# EAGLE design Totoro (EAGLE 9.6.2)
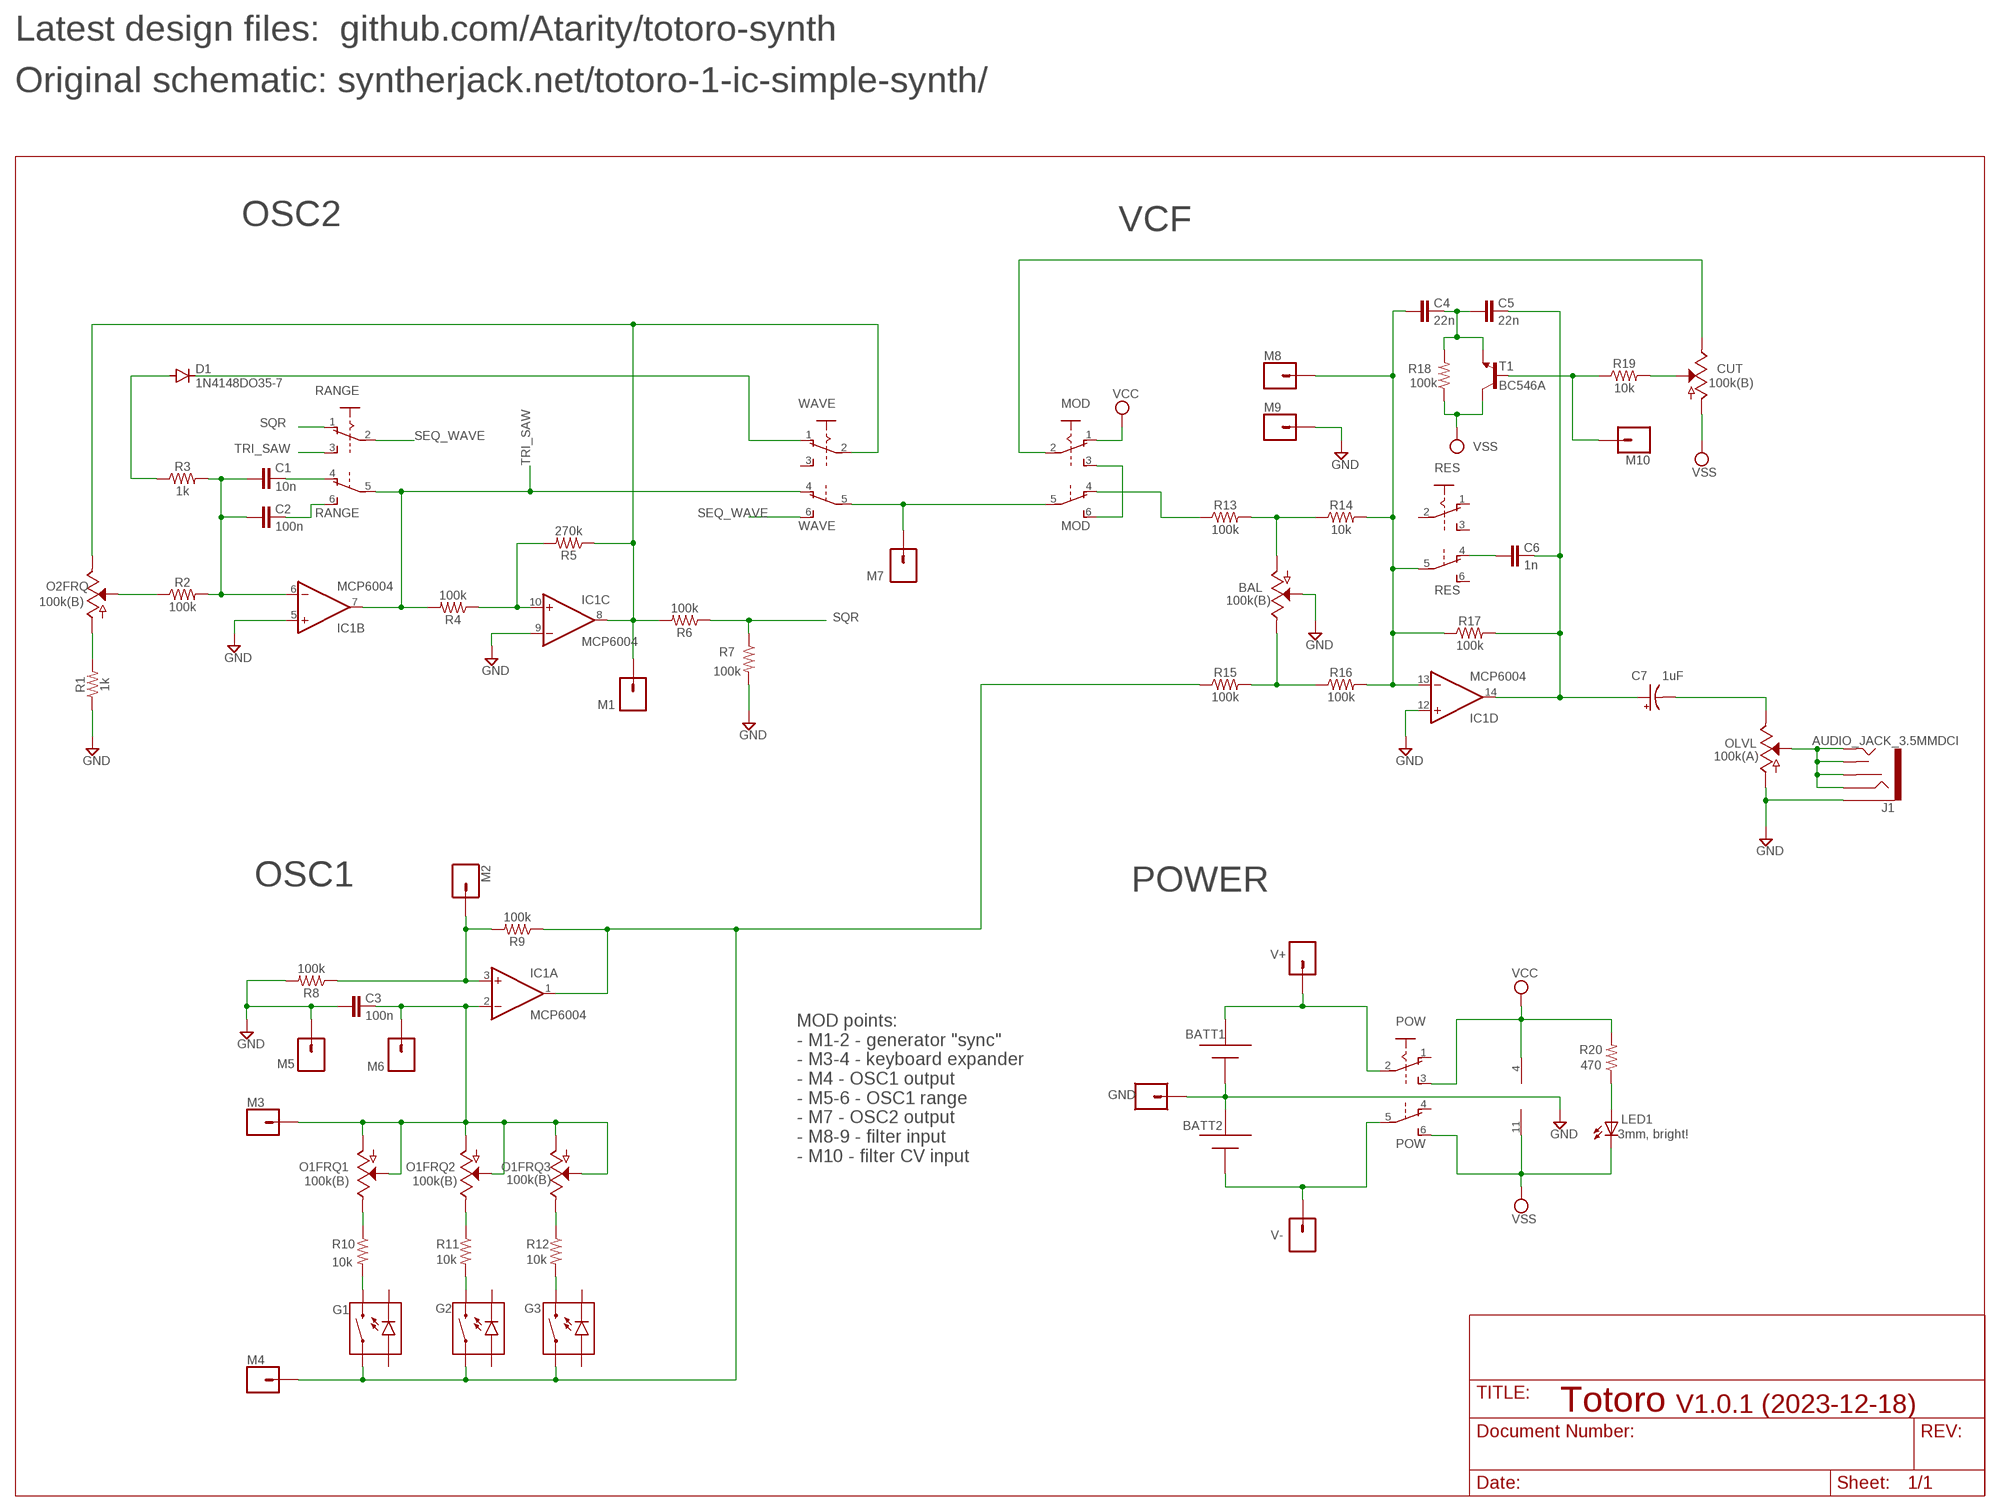
[diagram p0: schematic, sheet 1]

## Parts
BAL  100k(B)  POTENTIOMETER-GATE-SWAPPED  [POT-PTH-ALPS-KIT]
BATT1  ATARITY-AAAKLS5-817D  [KLS5-817-D]
BATT2  ATARITY-AAAKLS5-817D  [KLS5-817-D]
C1  10n  C-EU050-024X044  [C050-024X044]
C2  100n  C-EU050-024X044  [C050-024X044]
C3  100n  C-EU050-024X044  [C050-024X044]
C4  22n  C-EU050-024X044  [C050-024X044]
C5  22n  C-EU050-024X044  [C050-024X044]
C6  1n  C-EU050-024X044  [C050-024X044]
C7  1uF  10UF-POLAR-RADIAL-2.5MM-25V-20%  [CPOL-RADIAL-2.5MM-5MM]
CUT  100k(B)  POTENTIOMETER-GATE-SWAPPED  [POT-PTH-ALPS-KIT]
D1  1N4148DO35-7  [DO35-7]
G1  MECHANICAL-KEYBOARD1U  [CHERRY-MX-LED-1U]
G2  MECHANICAL-KEYBOARD1U  [CHERRY-MX-LED-1U]
G3  MECHANICAL-KEYBOARD1U  [CHERRY-MX-LED-1U]
GND  CONN_01  [1X01]
IC1  MCP6004  4AMP_P4+11N  [DIL14]
J1  AUDIO_JACK_3.5MMDCI  [DCI-ST-033]
LED1  3mm, bright!  LED3MM  [LED3MM]
M1  CONN_01  [1X01]
M2  CONN_01  [1X01]
M3  CONN_01  [1X01]
M4  CONN_01  [1X01]
M5  CONN_01  [1X01]
M6  CONN_01  [1X01]
M7  CONN_01  [1X01]
M8  CONN_01  [1X01]
M9  CONN_01  [1X01]
M10  CONN_01  [1X01]
MOD  PB22E07  [PB22E07]
O1FRQ1  100k(B)  POTENTIOMETER-GATE-SWAPPED  [POT-PTH-ALPS-KIT]
O1FRQ2  100k(B)  POTENTIOMETER-GATE-SWAPPED  [POT-PTH-ALPS-KIT]
O1FRQ3  100k(B)  POTENTIOMETER-GATE-SWAPPED  [POT-PTH-ALPS-KIT]
O2FRQ  100k(B)  POTENTIOMETER-GATE-SWAPPED  [POT-PTH-ALPS-KIT]
OLVL  100k(A)  POTENTIOMETER-GATE-SWAPPED  [POT-PTH-ALPS-KIT]
POW  PB22E07  [PB22E07]
R1  1k  RESISTORAXIAL-0.3  [AXIAL-0.3]
R2  100k  RESISTORAXIAL-0.3  [AXIAL-0.3]
R3  1k  RESISTORAXIAL-0.3  [AXIAL-0.3]
R4  100k  RESISTORAXIAL-0.3  [AXIAL-0.3]
R5  270k  RESISTORAXIAL-0.3  [AXIAL-0.3]
R6  100k  RESISTORAXIAL-0.3  [AXIAL-0.3]
R7  100k  RESISTORAXIAL-0.3  [AXIAL-0.3]
R8  100k  RESISTORAXIAL-0.3  [AXIAL-0.3]
R9  100k  RESISTORAXIAL-0.3  [AXIAL-0.3]
R10  10k  RESISTORAXIAL-0.3  [AXIAL-0.3]
R11  10k  RESISTORAXIAL-0.3  [AXIAL-0.3]
R12  10k  RESISTORAXIAL-0.3  [AXIAL-0.3]
R13  100k  RESISTORAXIAL-0.3  [AXIAL-0.3]
R14  10k  RESISTORAXIAL-0.3  [AXIAL-0.3]
R15  100k  RESISTORAXIAL-0.3  [AXIAL-0.3]
R16  100k  RESISTORAXIAL-0.3  [AXIAL-0.3]
R17  100k  RESISTORAXIAL-0.3  [AXIAL-0.3]
R18  100k  RESISTORAXIAL-0.3  [AXIAL-0.3]
R19  10k  RESISTORAXIAL-0.3  [AXIAL-0.3]
R20  470  RESISTORAXIAL-0.3  [AXIAL-0.3]
RANGE  PB22E07  [PB22E07]
RES  PB22E07  [PB22E07]
T1  BC546A  [TO92-EBC]
V+  CONN_01  [1X01]
V-  CONN_01  [1X01]
WAVE  PB22E07  [PB22E07]

## Nets
GND: BAL.P$2(S) BATT1.+ BATT2.- C3.2 GND.1 IC1.5(B:+IN) IC1.9(C:-IN) IC1.12(D:+IN) J1.P2(SLEEVE) J1.P3(SLEEVE) M5.1 M9.1 OLVL.P$1(A) R1.P$1 R7.P$2 R8.P$2
N$1: C1.2 C2.2 IC1.6(B:-IN) R2.P$2 R3.P$2
N$2: O2FRQ.P$2(S) R2.P$1
N$3: O2FRQ.P$1(A) R1.P$2
N$4: C1.1 RANGE.4(B:O)
N$5: C2.1 RANGE.6(B:S)
N$6: M7.1 MOD.5(B:P) WAVE.5(B:P)
N$7: IC1.10(C:+IN) R4.P$1 R5.P$2
N$8: IC1.8(C:OUT) M1.1 O2FRQ.P$3(E) R5.P$1 R6.P$2 WAVE.2(A:P)
N$9: D1.A R3.P$1
N$10: D1.C WAVE.1(A:O)
N$11: MOD.3(A:S) MOD.6(B:S)
N$12: MOD.4(B:O) R13.P$1
N$13: BAL.P$3(E) R15.P$2 R16.P$1
N$14: BAL.P$1(A) R13.P$2 R14.P$1
N$15: C4.2 IC1.13(D:-IN) M8.1 R14.P$2 R16.P$2 R17.P$1 RES.5(B:P)
N$16: C6.2 RES.4(B:O)
N$17: C5.1 C6.1 C7.1(+) IC1.14(D:OUT) R17.P$2
N$18: M10.1 R19.P$1 T1.B
N$19: C4.1 C5.2 R18.P$2 T1.E
N$20: CUT.P$2(S) R19.P$2
N$21: CUT.P$3(E) MOD.2(A:P)
N$22: C7.2(-) OLVL.P$3(E)
N$23: J1.P0(TIP) J1.P1(RING) J1.P4(RSH) J1.P5(TSH) OLVL.P$2(S)
N$24: O1FRQ3.P$3(E) R12.P$1
N$25: G1.S2 R10.P$2
N$26: O1FRQ2.P$3(E) R11.P$1
N$27: G2.S2 R11.P$2
N$28: O1FRQ1.P$3(E) R10.P$1
N$29: G3.S2 R12.P$2
N$31: C3.1 IC1.2(A:-IN) M3.1 M6.1 O1FRQ1.P$1(A) O1FRQ1.P$2(S) O1FRQ2.P$1(A) O1FRQ2.P$2(S) O1FRQ3.P$1(A) O1FRQ3.P$2(S)
N$32: IC1.3(A:+IN) M2.1 R8.P$1 R9.P$2
N$34: G1.S1 G2.S1 G3.S1 IC1.1(A:OUT) M4.1 R9.P$1 R15.P$1
N$35: LED1.A R20.P$1
N$37: BATT1.- POW.2(A:P) V+.1
N$38: BATT2.+ POW.5(B:P) V-.1
SEQ_WAVE: RANGE.2(A:P) WAVE.6(B:S)
SQR: R6.P$1 R7.P$1 RANGE.1(A:O)
TRI_SAW: IC1.7(B:OUT) R4.P$2 RANGE.3(A:S) RANGE.5(B:P) WAVE.4(B:O)
VCC: IC1.4(P:V+) MOD.1(A:O) POW.3(A:S) R20.P$2
VSS: CUT.P$1(A) IC1.11(P:V-) LED1.K(C) POW.6(B:S) R18.P$1 T1.C
Unconnected: G1.A G1.K(C) G2.A G2.K(C) G3.A G3.K(C) POW.1(A:O) POW.4(B:O) RES.1(A:O) RES.2(A:P) RES.3(A:S) RES.6(B:S) WAVE.3(A:S)

## Notes on the sheet
- Latest design files:  github.com/Atarity/totoro-synth
- Original schematic: syntherjack.net/totoro-1-ic-simple-synth/
- OSC2 | VCF
- OSC1 | POWER
- MOD points:
  - M1-2 - generator "sync"
  - M3-4 - keyboard expander
  - M4 - OSC1 output
  - M5-6 - OSC1 range
  - M7 - OSC2 output
  - M8-9 - filter input
  - M10 - filter CV input
- V1.0.1 (2023-12-18)

## Library data of the parts
BAL CUT O1FRQ1-O1FRQ3 O2FRQ OLVL = SparkFun-Resistors:POTENTIOMETER: Potentiometer (Pot) Three-terminal potentiometers, with an adjustable wiper and two adjustable resistors. A pot can be used to create a configurable voltage divider, or as a variable resistor. Variants ALPS_POT and ALPS_POT_KIT - PTH, breadboard compatible, 9mm square pots Rotary Potentiometer - Linear (10k ohm) <https://www.sparkfun.com/products/9288> (COM-09288) The KIT variant exposes copper on only one side of the PTH pad, so the part can only be assembled on one side of the PCB. Useful for beginner soldering kits.
BATT1 BATT2 = adafruit:ATARITY-AAA: AAA PC pin holder Mouser part #12BH412 - but pretty much any 1x AAA battery holder should be the same http://www.ladyada.net/library/pcb/eaglelibrary.html
C1-C6 = rcl:C-EU: CAPACITOR, European symbol; SPICEPREFIX: C
C7 = SparkFun-Capacitors:10UF-POLAR: 10.0µF polarized capacitors A capacitor is a passive two-terminal electrical component used to store electrical energy temporarily in an electric field.; PROD_ID: CAP-08440; VALUE: 10uF
D1 = diode:1N4148: DIODE high speed (Philips)
G1-G3 = SparkFun-Switches:MECHANICAL-KEYBOARD: Mechanical Keyboard Spacings for Cherry-MX Cherry-MX w/ LED switch footprints. Each package variant contains a bounding box on the tDocu layer for proper key spacing and a dimensional drawing on the Reference layer to be exported for laser cut mounting plates. Footprints are off-center so that the origin lies on the lower left corner of the key-spacing. This allows for most common layouts to be easily acheived on a grid spacing of 0.1875" Variants 1U through 1.75U in .25U steps Centered switch cutout in SwitchPlate layer with no stabilizers 2U through 2.75U in .25U steps Centered switch cutout in SwitchPlate layer with Cherry+Costar stabilizer holes 6.25U Common spacebar size Centered switch cutout in SwitchPlate layer with Cherry+Costar stabilizer holes "Big Ass" Enter ANSI 104 "Big Ass" Enter Key layout ISO Enter ISO style Enter Key layout
GND M1-M10 V+ V- = SparkFun-Connectors:CONN_01: Single connection point. Often used as Generic Header-pin footprint for 0.1 inch spaced/style header connections On any of the 0.1 inch spaced packages, you can populate with these: Break Away Headers - Straight <https://www.sparkfun.com/products/116> (PRT-00116) Break Away Male Headers - Right Angle <https://www.sparkfun.com/products/553> (PRT-00553) Female Headers <https://www.sparkfun.com/products/115> (PRT-00115) Break Away Headers - Machine Pin <https://www.sparkfun.com/products/117> (PRT-00117) Break Away Female Headers - Swiss Machine Pin <https://www.sparkfun.com/products/743> (PRT-00743) This device is also useful as a general connection point to wire up your design to another part of your project. Our various solder wires solder well into these plated through hole pads. Hook-Up Wire - Assortment (Stranded, 22 AWG) <https://www.sparkfun.com/products/11375> (PRT-11375) Hook-Up Wire - Assortment (Solid Core, 22 AWG) <https://www.sparkfun.com/products/11367> (PRT-11367) View the entire wire category on our website here <https://www.sparkfun.com/categories/141> Special notes: SMTSO-256-ET is a "flush mount" nut for a 4-40 screw. We mostly use this on specialty testbeds; it is a nice way to connect hardware to your PCB at an adjustable hieght. Also note, the SNAP packages are for using a snappable style connector. We sell a baggie of snaps and they are also used on two LilyPad designs: Snap Assortment - 30 pack (male and female) <https://www.sparkfun.com/products/11347> (DEV-11347) LilyPad Arduino SimpleSnap <https://www.sparkfun.com/products/10941> (DEV-10941) LilyPad SimpleSnap Protoboard <https://www.sparkfun.com/products/10940> (DEV-10940)
IC1 = linear:4AMP_P4+11: OP AMP
J1 = SparkFun-Connectors:AUDIO_JACK_3.5MM: Audio Jack 3.5mm variants of PTH and SMT stereo audio jack with bypass switches. SparkFun Products: SparkFun SparkPunk Sound Kit <[https://www.sparkfun.com/products/11177]> - PTH MP3 Trigger <https://www.sparkfun.com/products/13720> -3.5mm SMD SparkFun PicoBoard <https://www.sparkfun.com/products/11888>- 2.5mm SMD
LED1 = adafruit:LED: LED OSRAM: - CHIPLED LG R971, LG N971, LY N971, LG Q971, LY Q971, LO R971, LY R971 LH N974, LH R974 LS Q976, LO Q976, LY Q976 LO Q996 - Hyper CHIPLED LW Q18S LB Q993, LB Q99A, LB R99A - SideLED LS A670, LO A670, LY A670, LG A670, LP A670 LB A673, LV A673, LT A673, LW A673 LH A674 LY A675 LS A676, LA A676, LO A676, LY A676, LW A676 LS A679, LY A679, LG A679 - Hyper Micro SIDELED® LS Y876, LA Y876, LO Y876, LY Y876 LT Y87S - SmartLED LW L88C, LW L88S LB L89C, LB L89S, LG L890 LS L89K, LO L89K, LY L89K LS L896, LA L896, LO L896, LY L896 - TOPLED LS T670, LO T670, LY T670, LG T670, LP T670 LSG T670, LSP T670, LSY T670, LOP T670, LYG T670 LG T671, LOG T671, LSG T671 LB T673, LV T673, LT T673, LW T673 LH T674 LS T676, LA T676, LO T676, LY T676, LB T676, LH T676, LSB T676, LW T676 LB T67C, LV T67C, LT T67C, LS T67K, LO T67K, LY T67K, LW E67C LS E67B, LA E67B, LO E67B, LY E67B, LB E67C, LV E67C, LT E67C LW T67C LS T679, LY T679, LG T679 LS T770, LO T770, LY T770, LG T770, LP T770 LB T773, LV T773, LT T773, LW T773 LH T774 LS E675, LA E675, LY E675, LS T675 LS T776, LA T776, LO T776, LY T776, LB T776 LHGB T686 LT T68C, LB T68C - Hyper Mini TOPLED® LB M676 - Mini TOPLED Santana® LG M470 LS M47K, LO M47K, LY M47K Source: http://www.osram.convergy.de/
MOD POW RANGE RES WAVE = atarity-switch-pb22e07:PB22E07: SLIDING SWITCH Siemens, distributor Buerklin, 11G766
R1-R20 = SparkFun-Resistors:RESISTOR: Generic Resistor Package
T1 = transistor-npn:BC546*: NPN Transistor

## Board
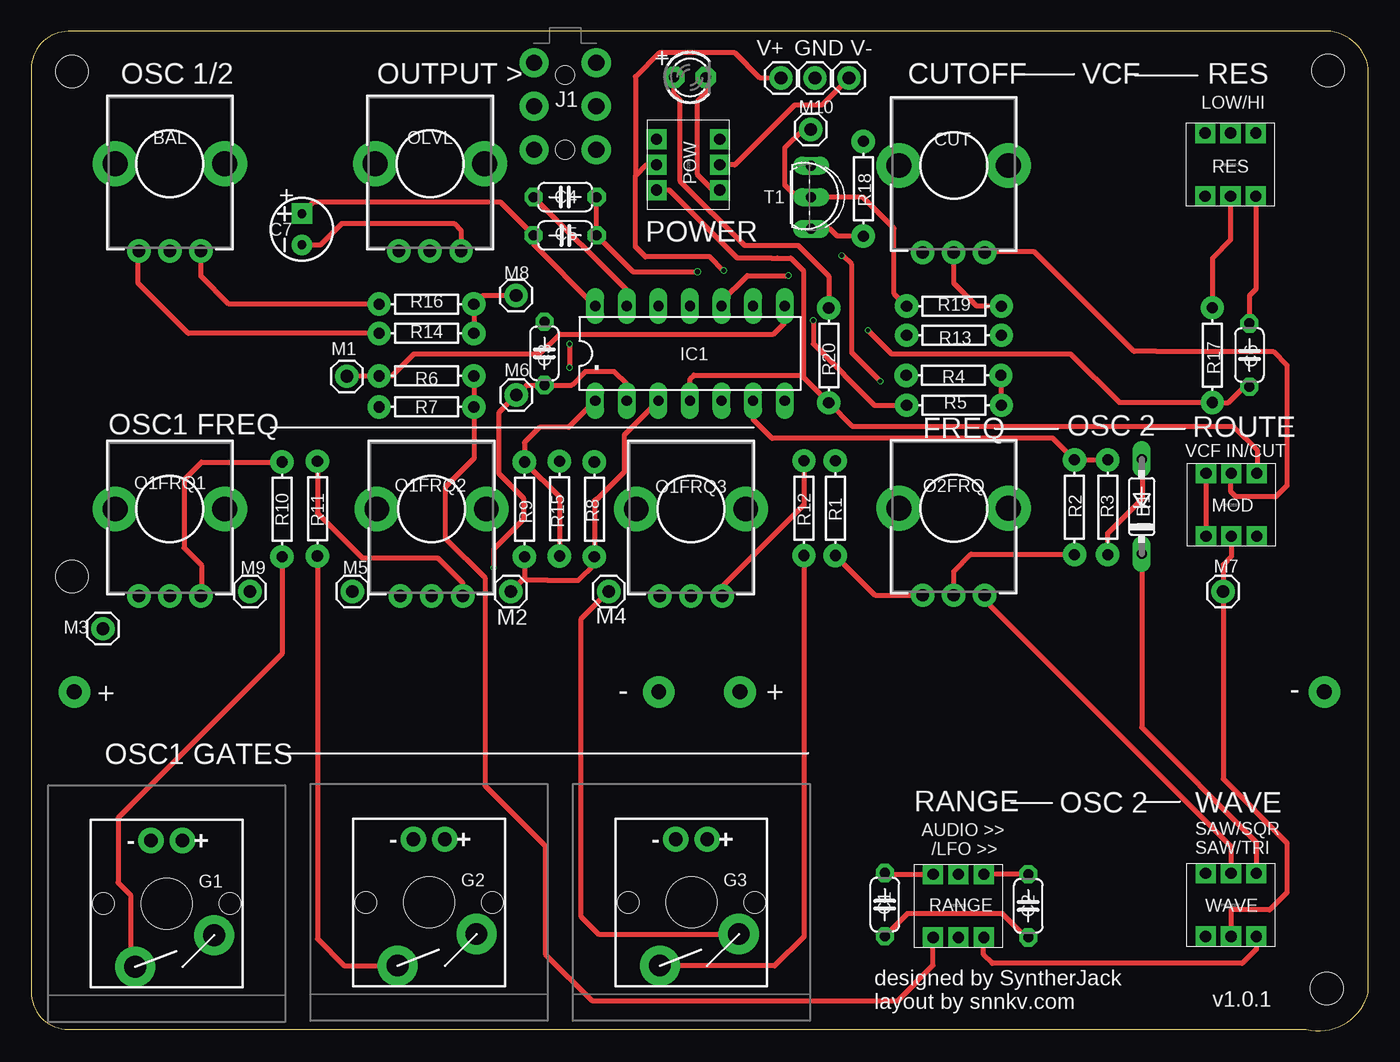
[diagram p1: board, top side]
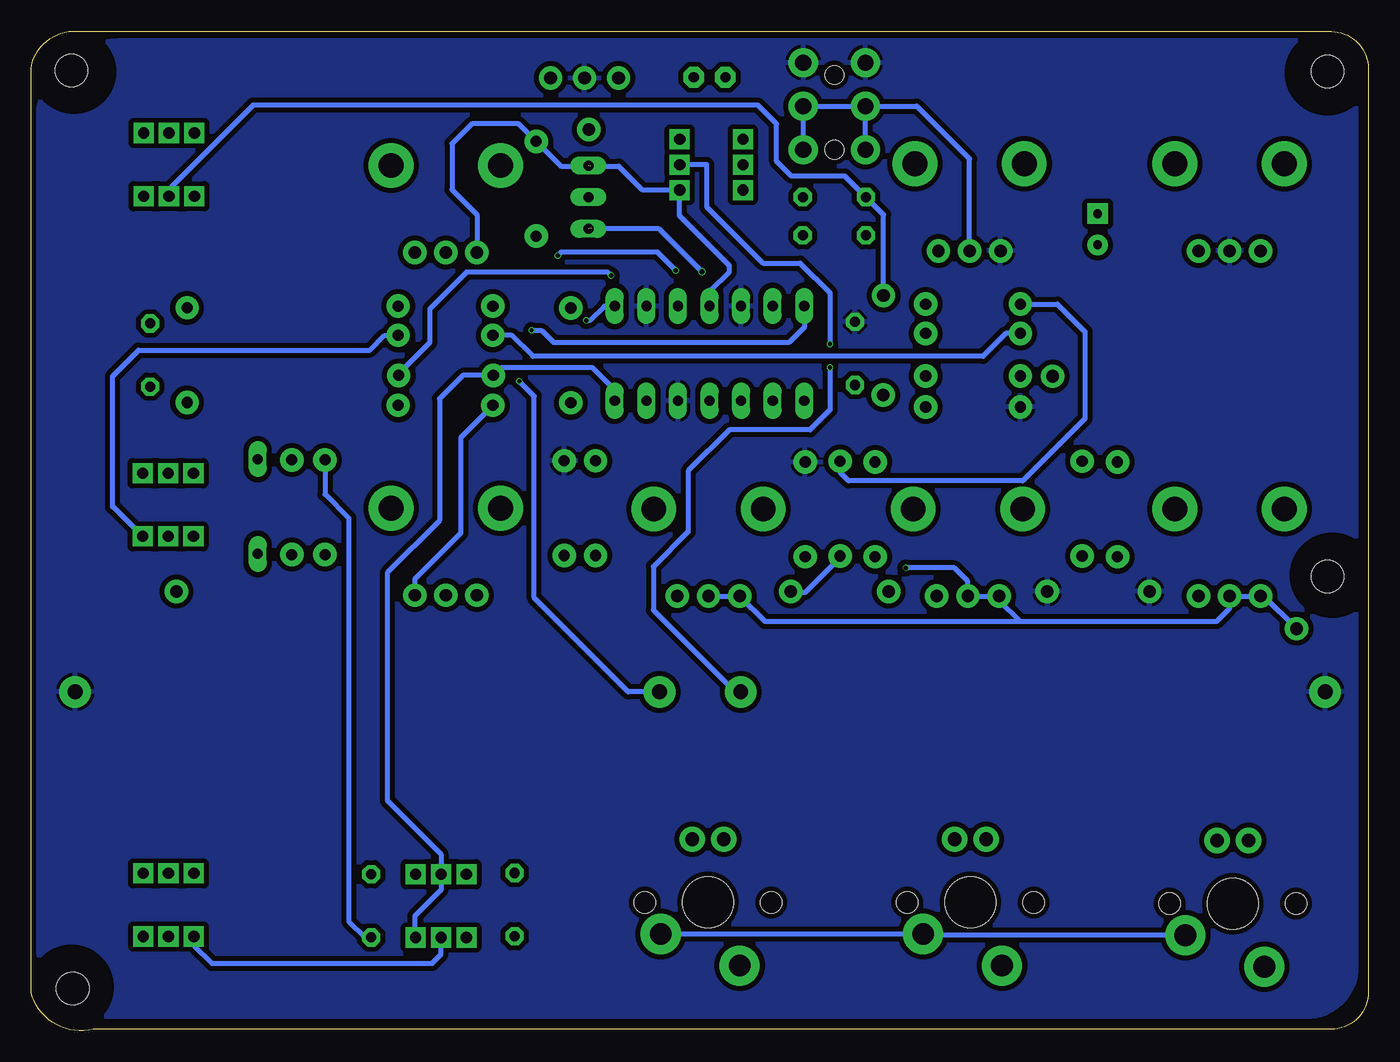
[diagram p2: board, bottom side, seen from below]

Size 107.55 x 80.37 mm. Coordinates in mm from the lower left corner, seen from the top.
Outline: 107.55,3.12 107.55,77.34 arc90 103.55,80.34 3,80.34 arc90 0,77.34 0,3.12 arc90 3,0.12 102.55,0.12 arc90 107.55,3.12
Copper layers (1*16): Top 0.035mm / dielectric 1.6mm / Bottom 0.035mm
Design rules "jlcpcb-2layers": minimum track width 5mil, minimum drill 0.3mm, track to track 5mil, track to pad 5mil, pad to pad 5mil, via to via 5mil, smd to smd 5mil, copper to edge 0.2mm, drill to drill 6mil, minimum pad ring 10mil, minimum via ring 3mil, stop-mask expansion 4mil, vias tented up to drill 0mil, thermal gap 10mil
Holes 2.6 mm at 3.3,77.12 104.3,77.22 104.2,3.42 3.3,36.52
bRestrict: area 0.3,74 to 6.3,80; area -0.1,33.6 to 5.9,39.6; area 101.1,74.1 to 107.1,80.1; area 101.3,0.5 to 107.3,6.5

### Footprints (pad centres in the part's own frame; a part is rotated, then mirrored left to right if it is on the bottom)
POT-PTH-ALPS-KIT = drill 1 pad 1.88: P$1 7,-2.5; P$2 7,0; P$3 7,2.5 | drill 2: P$4 0,-4.4; P$5 0,4.4
KLS5-817-D = drill 1.2 pad 2.54: + 25,0; - -22,0
C050-024X044 = drill 0.813 octagon: 1 -2.54,0; 2 2.54,0
CPOL-RADIAL-2.5MM-5MM = drill 0.7 pad 1.651 square: 1 1.25,0 | drill 0.7 pad 1.651: 2 -1.25,0
DO35-7 = drill 0.813 long: A 3.81,0; C -3.81,0
CHERRY-MX-LED-1U = drill 1.092 pad 2.032: A 8.255,4.445; K 10.795,4.445 | drill 1.753 pad 3.226: S1 5.715,12.065; S2 12.065,14.605 | hole 4.089: 9.525,9.525 | hole 1.707: 4.445,9.525; 14.605,9.525
1X01 = drill 1.016 pad 1.88: 1 0,0
DIL14 = drill 0.813 long: 1 -7.62,-3.81; 2 -5.08,-3.81; 3 -2.54,-3.81; 4 0,-3.81; 5 2.54,-3.81; 6 5.08,-3.81; 7 7.62,-3.81; 8 7.62,3.81; 9 5.08,3.81; 10 2.54,3.81; 11 0,3.81; 12 -2.54,3.81; 13 -5.08,3.81; 14 -7.62,3.81
DCI-ST-033 = drill 1.3: P0 -6,-2.5; P1 -2.5,-2.5; P2 1,-2.5; P3 1,2.5; P4 -2.5,2.5; P5 -6,2.5 | hole 1.5: 0,0; -6,0
LED3MM = drill 0.813 pad 1.676 octagon: A -1.27,0; K 1.27,0
PB22E07 = drill 0.9 square: 1 -0.04,-0.04; 2 2,-0.04; 3 4.04,-0.04; 4 -0.04,5.04; 5 2,5.04; 6 4.04,5.04
AXIAL-0.3 = drill 0.9 pad 1.88: P$1 -3.81,0; P$2 3.81,0
TO92-EBC = drill 0.813 long: B 0,-1.27; C -2.54,-1.27; E 2.54,-1.27

### Placement (x,y rotation side)
BAL  11.16,69.7 270 top
BATT1  79.01,27.25 0 top
BATT2  25.48,27.25 0 top
C1  68.66,10.15 270 top
C2  80.2,10.05 270 top
C3  41.29,54.46 90 top
C4  42.95,67.03 180 top
C5  42.95,63.95 0 top
C6  97.98,54.33 90 top
C7  21.77,64.44 90 top
CUT  74.2,69.57 270 top
D1  89.32,42.15 90 top
G1  20.43,19.75 180 top
G2  41.53,19.85 180 top
G3  62.63,19.85 180 top
GND  63.04,76.59 0 top
IC1  52.99,54.46 0 top
J1  42.95,76.84 90 top
LED1  52.99,76.66 0 top
M1  25.4,52.62 0 top
M2  38.59,35.33 0 top
M3  5.78,32.33 0 top
M4  46.45,35.33 0 top
M5  25.83,35.33 0 top
M6  39.02,51.11 0 top
M7  95.87,35.33 0 top
M8  39,59.12 0 top
M9  17.6,35.32 0 top
M10  62.7,72.46 0 top
MOD  98.53,44.79 180 top
O1FRQ1  11.16,41.95 270 top
O1FRQ2  32.21,41.95 270 top
O1FRQ3  53.07,41.95 270 top
O2FRQ  74.2,42.02 270 top
OLVL  32.08,69.7 270 top
POW  50.35,71.63 270 top
R1  64.68,42.02 270 top
R2  83.91,42.09 90 top
R3  86.59,42.09 90 top
R4  74.18,52.7 180 top
R5  74.22,50.29 0 top
R6  31.8,52.65 180 top
R7  31.8,50.16 180 top
R8  45.3,41.92 90 top
R9  39.68,41.92 270 top
R10  20.18,41.92 270 top
R11  23.03,41.98 270 top
R12  62.16,42.02 270 top
R13  74.22,55.92 180 top
R14  31.8,56.07 0 top
R15  42.49,41.98 90 top
R16  31.8,58.42 0 top
R17  95,54.32 270 top
R18  66.93,67.7 270 top
R19  74.22,58.26 0 top
R20  64.15,54.3 270 top
RANGE  72.58,7.55 0 top
RES  98.46,72.14 180 top
T1  64,67.02 270 top
V+  60.31,76.59 0 top
V-  65.77,76.59 0 top
WAVE  98.5,12.62 180 top

### Tracks (layer width: path | path; a pad name or v marks a point on that pad's centre or on a via)
GND
  pour Bottom (isolate 0.406): 107,7.12 107,73.12 arc90 100.5,79.62 5.5,79.62 arc90 1,75.12 1,5.12 arc90 5,1.12 101,1.12 arc90
N$1
  Top 0.406: C2.2 80.01,7.51 78.1,9.42 70.47,9.42 C1.2 | IC1.6 58.07,49.15 59.55,47.67 | 59.55,47.67 59.6,47.62 | 59.55,47.67 82.14,47.67 R2.P$2 R3.P$2
  Bottom 0.406: R2.P$2 83.91,43.13 82,41.22 82,8.81 80.7,7.51 C2.2
N$2
  Top 0.406: O2FRQ.P$2 74.2,36.92 75.6,38.32 83.87,38.32 R2.P$1
N$3
  Top 0.406: O2FRQ.P$1 67.87,35.02 R1.P$2
N$4
  Top 0.406: C1.1 68.76,12.59 RANGE.4
N$5
  Top 0.406: C2.1 RANGE.6
N$6
  Top 0.406: MOD.5 96.53,38.15 95.87,37.49 M7.1 95.87,20.25 101,15.12 101,11.12 99.6,9.72 96.5,9.72 WAVE.5
N$7  (via drill 0.35)
  Top 0.406: R4.P$1 77.99,50.33 R5.P$2 | IC1.10 55.53,58.65 57.6,60.72 v60.9,60.72
  Bottom 0.406: R4.P$1 77.99,52.83 75.5,55.32 75.5,58.02 72.5,61.02 61.2,61.02 v60.9,60.72
N$8  (via drill 0.35)
  Top 0.406: O2FRQ.P$3 76.7,34.62 96.5,14.82 WAVE.2 | M1.1 25.43,52.65 R6.P$2 29.03,52.65 30.8,54.42 40.9,54.42 42.5,56.02 59.7,56.02 60.61,56.93 IC1.8 | v62.9,57.12 62.9,55.22 67.83,50.29 R5.P$1
  Bottom 0.406: R5.P$1 73,47.7 73,40.02 76.7,36.32 O2FRQ.P$3 | v62.9,57.12 62.6,57.12 61.45,58.27 IC1.8
N$9
  Top 0.406: D1.A 89.4,45.88 89.4,42.82 86.59,40.01 R3.P$1
N$10
  Top 0.406: D1.C 89.32,24.4 98.54,15.18 WAVE.1
N$11
  Top 0.406: MOD.3 MOD.6
N$12
  Bottom 0.406: MOD.4 100.94,42.12 101,42.12 101,52.62 98.9,54.72 80.3,54.72 79.1,55.92 R13.P$1
N$13
  Top 0.406: BAL.P$3 13.66,60.66 15.9,58.42 R16.P$1
  Bottom 0.406: R16.P$1 25,58.42 22.8,56.22 22.8,49.22 27.8,44.22 41.8,44.22 42.49,44.91 R15.P$2
N$14
  Top 0.406: BAL.P$1 8.6,62.64 8.6,60.12 12.65,56.07 R14.P$1
  Bottom 0.406: R14.P$1 29.15,56.07 31,54.22 67.2,54.22 68.9,55.92 R13.P$2
N$15
  Top 0.406: 38.86,59.12 M8.1 36.31,59.12 R16.P$2 R14.P$2 | RES.5 96.46,63.58 95,62.12 R17.P$1 | C4.2 47.91,59.53 IC1.13
  Bottom 0.406: M8.1 39,65.62 C4.2 42.1,68.72 46.4,68.72 47.6,69.92 47.6,72.92 49.1,74.42 89.7,74.42 96.46,67.66 RES.5
N$16
  Top 0.406: RES.4 98.5,59.62 97.98,59.1 C6.2
N$17  (via drill 0.35)
  Top 0.406: C6.1 97.58,51.79 96.3,50.51 R17.P$2 87.5,50.52 83.6,54.42 69.2,54.42 v67.3,56.32 | IC1.14 40.41,63.23 C5.1 37.74,66.62 22.7,66.62 C7.1
  Bottom 0.406: IC1.14 45.37,56.55 46.6,55.32 65.5,55.32 66.5,56.32 v67.3,56.32
N$18
  Top 0.406: M10.1 62.1,72.46 60.6,70.96 60.6,68.02 61.65,66.97 61.7,67.02 T1.B 66.9,67.02 69.4,64.52 69.4,59.27 R19.P$1
N$19  (via drill 0.4)  (1 unrouted)
  Top 0.406: R18.P$2 64.83,63.89 64.24,64.48 T1.E | v53.6,61.02 48.42,61.02 C5.2 C4.1
  Bottom 0.406: 62.49,64.52 57.1,64.52 v53.6,61.02
N$20
  Top 0.406: R19.P$2 76.06,58.26 74.2,60.12 CUT.P$2
N$21
  Top 0.406: MOD.2 96.5,44.8 96.5,43.32 96.9,42.92 100.1,42.92 101,43.82 101,53.52 99.9,54.62 91,54.62 90.5,54.62 88.7,54.62 80.7,62.62 76.75,62.62 CUT.P$3
N$22
  Top 0.406: C7.2 23.27,63.19 25,64.92 34,64.92 34.6,64.32 34.6,62.72 OLVL.P$3
N$23
  Bottom 0.406: OLVL.P$2 32.08,70.1 36.32,74.34 J1.P4 | J1.P0 J1.P1 J1.P4 | J1.P5 J1.P4
N$24
  Top 0.406: R12.P$1 62.16,42.28 55.57,35.69 O1FRQ3.P$3
N$25
  Top 0.406: R10.P$2 20.18,30.3 7,17.12 7,11.92 8,10.92 8,5.51 G1.S2
N$26
  Top 0.406: R11.P$1 23.03,41.63 26.64,38.02 32.7,38.02 34.71,36.01 O1FRQ2.P$3
N$27
  Top 0.406: R11.P$2 23.03,7.39 25.18,5.25 G2.S2
N$28
  Top 0.406: R10.P$1 13.71,45.73 12.3,44.32 12.3,38.82 13.7,37.42 13.7,34.99 O1FRQ1.P$3
N$29
  Top 0.406: R12.P$2 62.16,7.58 59.8,5.22 50.59,5.22 G3.S2
N$31  (via drill 0.35)
  Top 0.406: IC1.2 47.91,52.01 46.9,53.02 44.59,53.02 43.49,51.92 C3.1 39.83,51.92 M6.1 37.6,49.69 37.6,44.82 39.6,42.82 39.6,41.12 37.2,38.72 v37.2,37.22
  Bottom 0.406: 28,32.92 48.54,32.92 O1FRQ3.P$1 O1FRQ3.P$2 53,35.02 | 28,32.92 12.2,32.92 11.16,33.96 O1FRQ1.P$2 O1FRQ1.P$1 8.4,34.95 M3.1 | 28,32.92 29.71,34.63 O1FRQ2.P$1 O1FRQ2.P$2 32.21,36.13 33.3,37.22 v37.2,37.22
N$32
  Top 0.406: R9.P$2 39.68,36.42 39.48,36.22 | M2.1 39.19,35.93 39.48,36.22 | IC1.3 47.7,47.9 47.7,44.92 45.5,42.72 45.4,42.72 45.3,42.62 R8.P$1 45.3,37.52 44,36.22 42,36.22 41.57,36.22 39.48,36.22
  Bottom 0.406: 38.7,35.44 M2.1
N$34
  Top 0.406: G3.S1 45.63,7.79 44.2,9.22 44.2,33.08 M4.1 | R15.P$1 42.49,42.92 R9.P$1 39.68,47.3 40.9,48.52 43.24,48.52 IC1.1
  Bottom 0.406: G1.S1 35.72,7.69 G2.S1 G3.S1 | R15.P$1 42.49,38.03 45.3,35.22 46.34,35.22 M4.1
N$35
  Top 0.406: R20.P$1 64.2,58.16 64.2,60.62 61.7,63.12 57.4,63.12 52.2,68.32 52.2,74.82 51.8,75.22 51.7,75.22 51.7,76.64 LED1.A
N$37  (via drill 0.35)
  Top 0.406: v68.3,52.22 66,54.52 66,61.62 65.3,62.32 v65.2,62.32 | v55.7,61.12 54.6,62.22 49.4,62.22 48.6,63.02 48.6,68.72 | 48.6,68.72 49.51,69.63 POW.2 | V+.1 58.63,76.59 56.6,78.62 50.5,78.62 48.6,76.72 48.6,68.72
  Bottom 0.406: BATT1.- 59.53,27.25 67.1,34.82 67.1,51.02 v68.3,52.22 | v55.7,61.12 57.2,62.62 64.9,62.62 v65.2,62.32
N$38  (via drill 0.35)
  Top 0.406: V-.1 63.6,74.42 61.4,74.42 56.6,69.62 POW.5 | v43.3,55.22 v43.3,53.32
  Bottom 0.406: v43.3,55.22 43.3,59.32 45.7,61.72 48.7,61.72 53.2,66.22 53.2,69.62 53.21,69.63 POW.5 | v43.3,53.32 43.3,49.92 44.9,48.32 51.4,48.32 54.7,45.02 54.7,40.12 57.5,37.32 57.5,33.82 50.93,27.25 BATT2.+
SEQ_WAVE
  Bottom 0.406: WAVE.6 94.46,6.88 93,5.42 75.3,5.42 74.58,6.14 RANGE.2
SQR
  Top 0.406: RANGE.1 72.54,5.26 69.7,2.42 45.1,2.42 41.35,6.17 41.35,14.87 36.5,19.72 36.5,36.42 33.3,39.62 33.3,43.72 35.61,46.03 R7.P$1 R6.P$1
TRI_SAW
  Top 0.406: WAVE.4 98.54,6.56 97.4,5.42 77.3,5.42 76.6,6.12 76.6,7.49 RANGE.3
  Bottom 0.406: IC1.7 60.61,51.53 62.4,53.32 69.75,53.32 R4.P$2 72.82,52.7 74.7,50.82 74.7,41.02 78.9,36.82 78.9,18.52 74.58,14.2 RANGE.5 | 74.6,12.61 RANGE.5 | RANGE.5 74.58,11.34 76.7,9.22 76.7,7.59 RANGE.3
VCC
  Top 0.406: 62.1,52.72 62.1,61.12 61.1,62.12 60,62.12 59.54,62.12 56.8,62.12 51.33,67.59 POW.3 | 62.1,52.72 62.1,52.54 R20.P$2 66.02,48.62 96.7,48.62 98.6,46.72 98.6,44.86 MOD.1 | IC1.4 53,52.42 53.3,52.72 62.1,52.72
VSS  (1 unrouted)
  Top 0.406: POW.6 54.83,67.59 53.6,68.82 53.6,74.72 54.2,75.32 54.3,75.32 54.3,76.62 LED1.K
  Bottom 0.152: 62.78,69.51 T1.C
  Bottom 0.406: 62.57,69.52 60.3,69.52 58.4,67.62 55.42,67.62 | IC1.11 53,59.52 52.9,59.52 51.4,61.02 51.4,61.52 55.42,65.54 55.42,67.62 | 55.42,67.62 POW.6 | CUT.P$1 71.7,65.62 73.7,67.62 73.7,71.32 72.1,72.92 68.34,72.92 R18.P$1 64.93,69.51 62.78,69.51

### Text on the board
tNames: + | OSC 1/2 | OUTPUT > | CUTOFF | VCF | RES | LOW/HI | + | POWER | . | OSC1 FREQ | OSC 2 | ROUTE | FREQ | VCF IN/CUT | - | + | - | + | OSC1 GATES | RANGE | OSC 2 | WAVE | AUDIO >> / /LFO >> | SAW/SQR / SAW/TRI | designed by SyntherJack / layout by snnkv.com | v1.0.1